# EAGLE schematic Display (EAGLE 7.2.0)
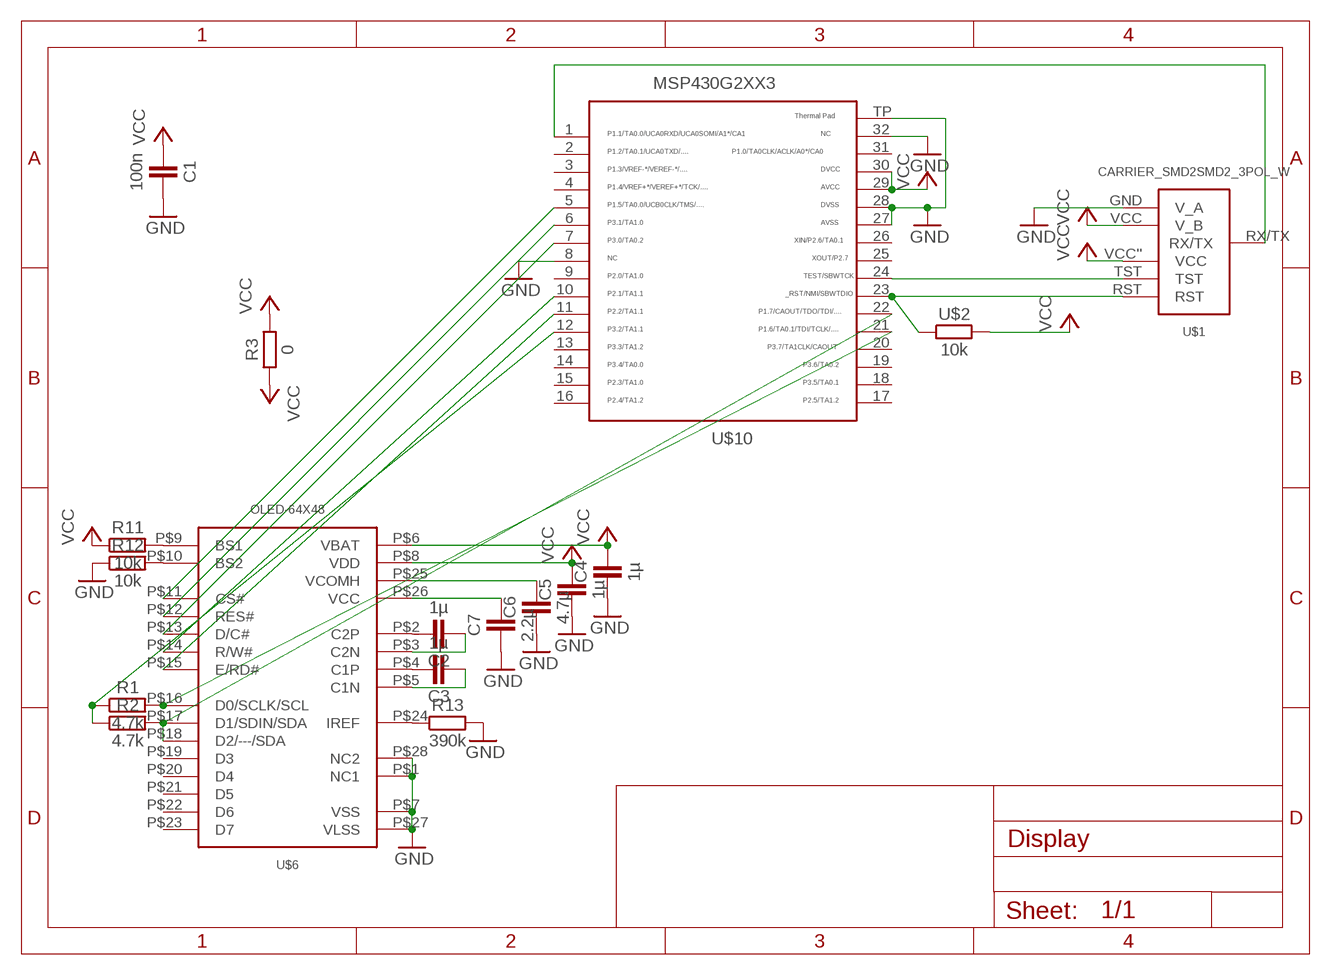
[diagram p0: schematic, sheet 1]

## Parts
C1  100n  CAPACITOR  [603]
C2  1µ  CAPACITOR  [603]
C3  1µ  CAPACITOR  [603]
C4  1µ  CAPACITOR  [603]
C5  1µ  CAPACITOR  [603]
C6  4.7µ  CAPACITOR  [603]
C7  2.2µ  CAPACITOR  [603]
R1  4.7k  RESISTOR0603  [603]
R2  4.7k  RESISTOR0603  [603]
R3  0  RESISTOR0603  [603]
R11  10k  RESISTOR0603  [603]
R12  10k  RESISTOR0603  [603]
R13  390k  RESISTOR0603  [603]
U$1  CARRIER_SMD2SMD2_3POL_W  [CARRIER_SMD2_WIDE_3POL]
U$2  10k  RESISTOR0603  [603]
U$6  OLED-64X48  [OLED_DISPLAY]
U$10  MSP430G2553  [QFN32]

## Nets
GND: C1.2 C4.1 C5.1 C6.1 C7.1 R12.1 R13.2 U$1.GND(V_A) U$6.P$1(NC1) U$6.P$7(VSS) U$6.P$27(VLSS) U$6.P$28(NC2) U$10.8 U$10.27 U$10.28 U$10.32 U$10.TP
N$2: R1.2 U$6.P$16(D0/SCLK/SCL) U$10.21
N$3: U$1.TST U$10.24
N$4: U$1.RST U$2.1 U$10.23
N$5: U$6.P$11(CS#) U$10.5
N$6: U$6.P$12(RES#) U$10.6
N$7: R2.2 U$6.P$17(D1/SDIN/SDA) U$6.P$18(D2/---/SDA) U$10.22
N$11: U$6.P$13(D/C#) U$10.7
N$12: U$1.RX/TX U$10.1
N$13: R11.2 U$6.P$9(BS1)
N$14: R12.2 U$6.P$10(BS2)
N$16: R13.1 U$6.P$24(IREF)
N$17: C2.2 U$6.P$2(C2P)
N$18: C3.2 U$6.P$4(C1P)
N$19: C3.1 U$6.P$5(C1N)
N$20: C2.1 U$6.P$3(C2N)
N$21: U$6.P$14(R/W#) U$10.10
N$22: U$6.P$15(E/RD#) U$10.11
N$23: R1.1 R2.1 U$10.12
N$24: C7.2 U$6.P$26(VCC)
N$25: C6.2 U$6.P$25(VCOMH)
VCC: C1.1 C4.2 C5.2 R3.1 R3.2 R11.1 U$1.VCC''(VCC) U$1.VCC(V_B) U$2.2 U$6.P$6(VBAT) U$6.P$8(VDD) U$10.29 U$10.30
Unconnected: U$6.P$19(D3) U$6.P$20(D4) U$6.P$21(D5) U$6.P$22(D6) U$6.P$23(D7) U$10.2 U$10.3 U$10.4 U$10.9 U$10.13 U$10.14 U$10.15 U$10.16 U$10.17 U$10.18 U$10.19 U$10.20 U$10.25 U$10.26 U$10.31

## Library data of the parts
C1-C7 = thar:CAPACITOR
R1-R3 R11-R13 U$2 = thar:RESISTOR
U$1 = thar:CARRIER_SMD2
U$6 = thar:OLED-64X48: DENSITRON - DD-6448BE-3A - DISPLAY,OLED, 64X48, BLAU Farnell Best.Nr.: 1498838 Herst.Bez.: DD-6448BE-3A
U$10 = thar:MSP430G2553: TEXAS INSTRUMENTS MSP430G2553IRHB32R MCU, 16BIT, MSP430, 16MHZ, QFN-32 Farnell Best.Nr.: 2325726 Herst.Bez.: MSP430G2553IRHB32R